# EAGLE board FPGA Test Board (EAGLE 9.2.0)
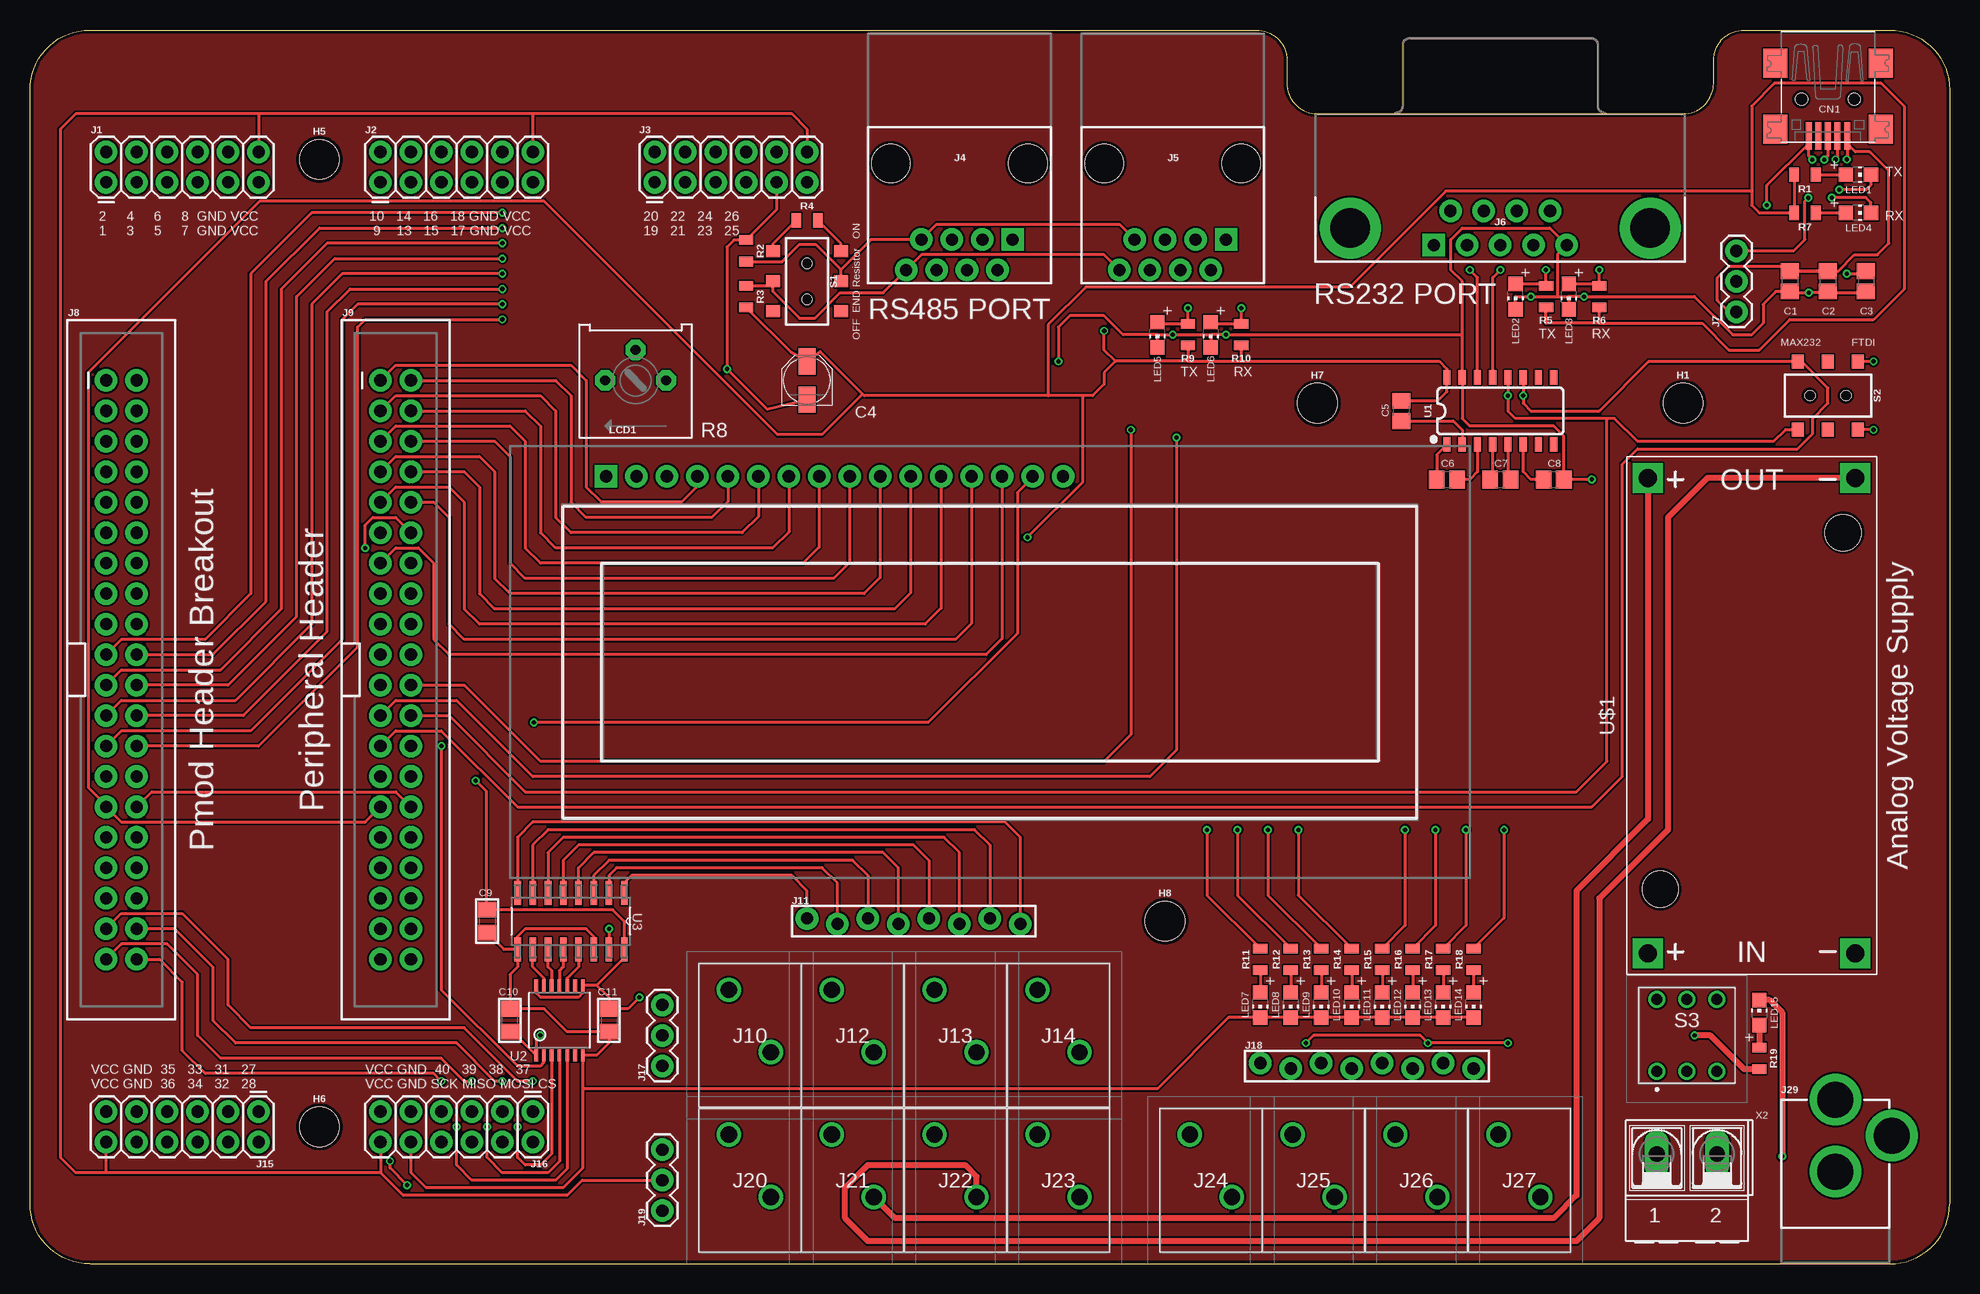
[diagram p4: board, top side]
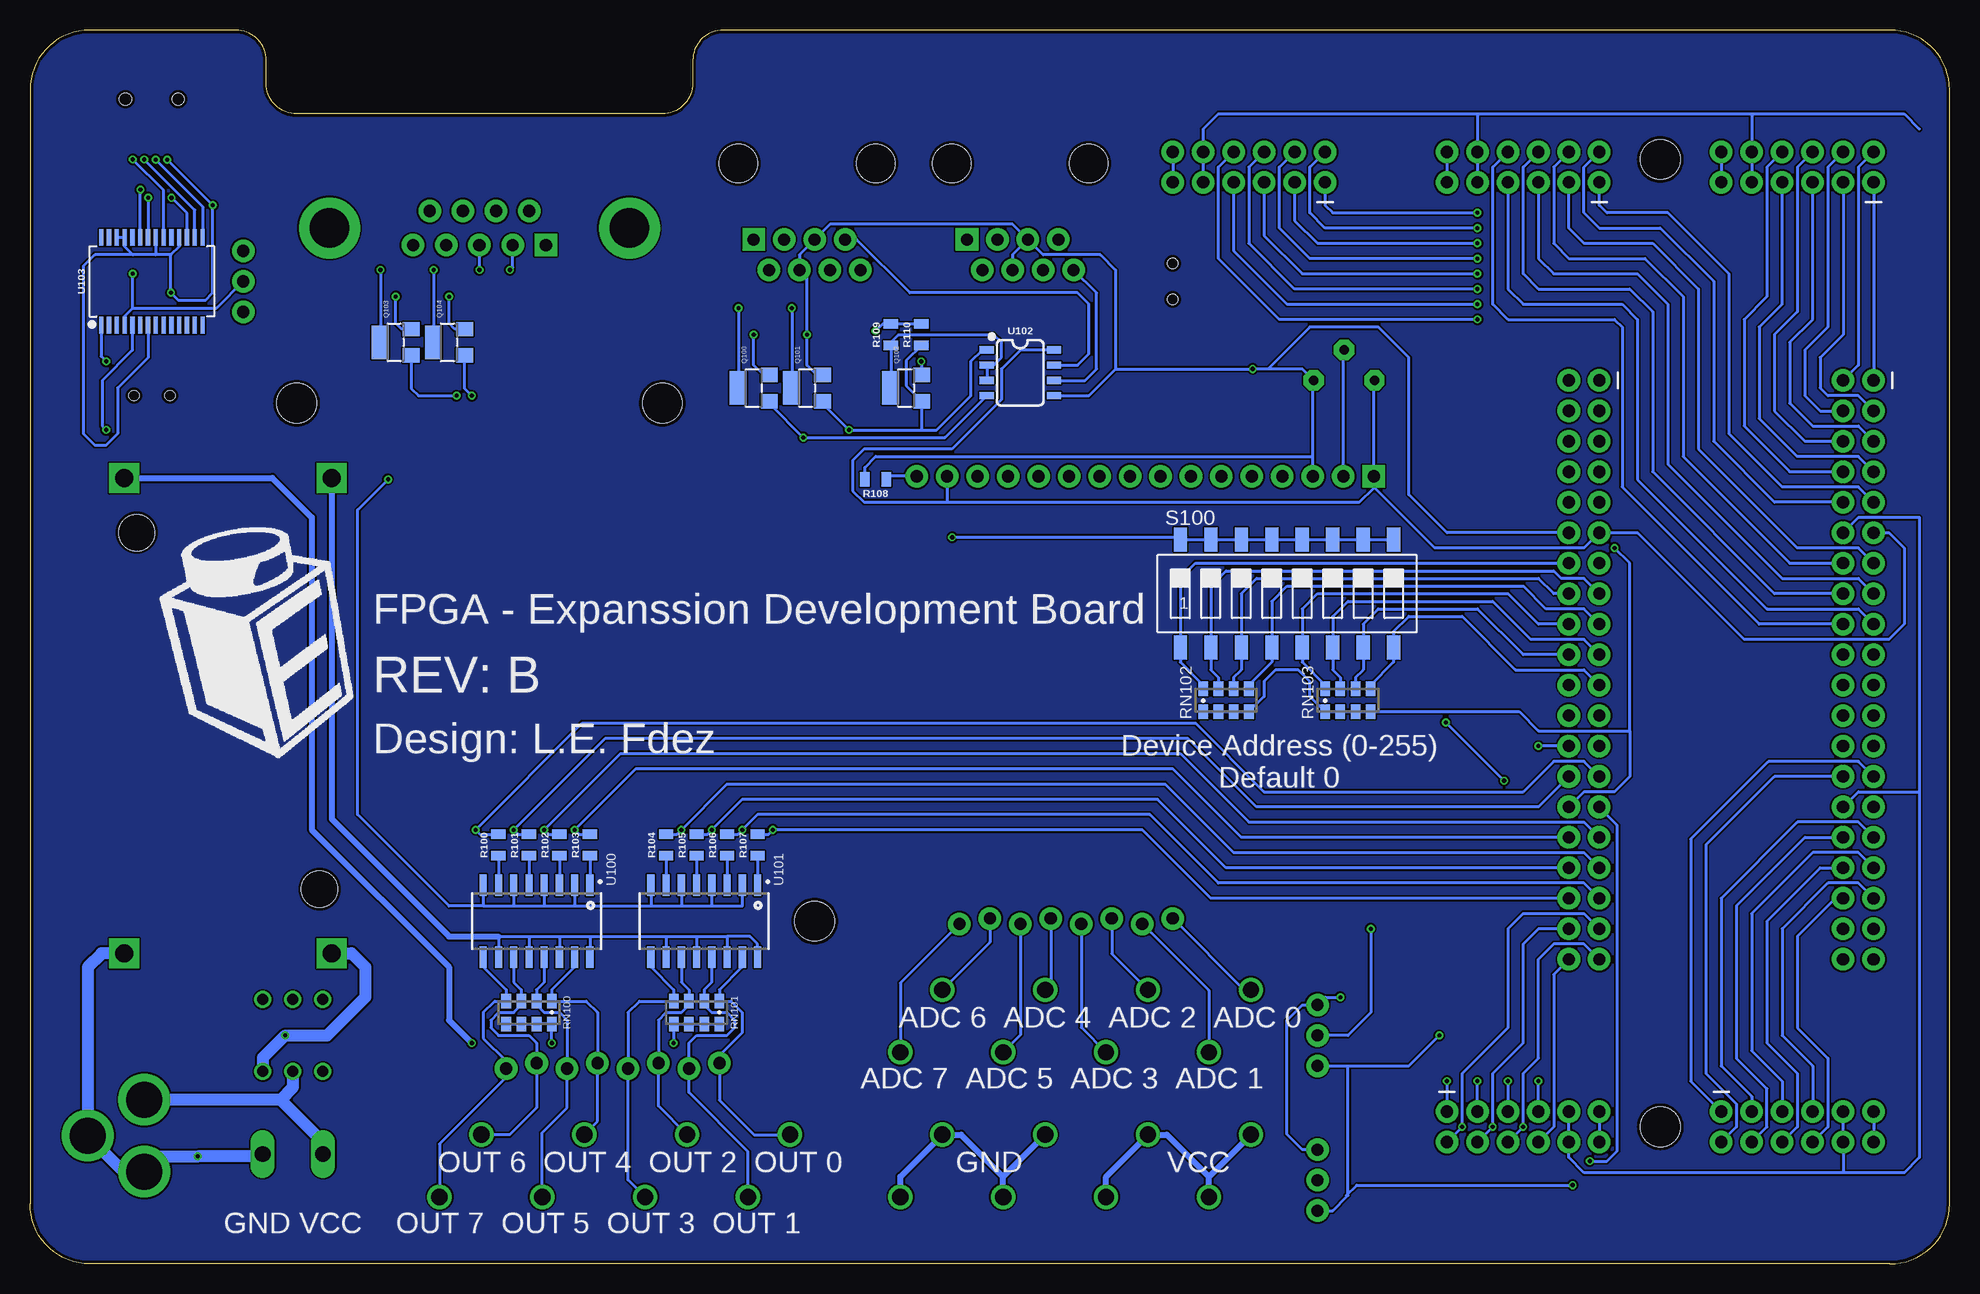
[diagram p5: board, bottom side, seen from below]

Size 160.02 x 102.87 mm. Coordinates in mm from the lower left corner, seen from the top.
Outline: 5,0 155.02,0 arc90 160.02,5 160.02,97.87 arc90 155.02,102.87 142.88,102.87 arc90 140.34,100.33 140.34,98.42 arc-90 137.79,95.89 107.31,95.89 arc-90 104.78,98.42 104.78,100.33 arc90 102.23,102.87 5,102.87 arc90 0,97.87 0,5 arc90 5,0
Copper layers (1*16): Top 0.035mm / dielectric 1.5mm / Bottom 0.035mm
Design rules "SeeedStudio_2layer_DRU_no_angle_20140221": minimum track width 6mil, minimum drill 12mil, track to track 6mil, track to pad 6mil, pad to pad 6mil, via to via 6mil, smd to smd 0mil, copper to edge 10mil, drill to drill 10mil, minimum pad ring 10mil, minimum via ring 6mil, stop-mask expansion 2mil, vias tented up to drill 100mil, thermal gap 10mil
Net classes: 1 power: width 0.254 mm

## Footprints (pad centres in the part's own frame; a part is rotated, then mirrored left to right if it is on the bottom)
C0805 = smd 1.3 x 1.5: 1 -0.85,0; 2 0.85,0
PANASONIC_B = smd 2.2 x 1.4: + 1.6,0; - -1.6,0
0805_NOTHERMALS = smd 1.3 x 1.5: 1 -0.95,0; 2 0.95,0
USB-MINIB = smd 0.5 x 2.308: D+ 0,4.064; D- -0.8,4.064; GND 1.6,4.064; ID 0.8,4.064; VBUS -1.6,4.064 | smd 2 x 2.4: GND1 -4.4,-2; GND2 -4.4,3.5; GND3 4.4,3.5; GND4 4.4,-2 | hole 1: -2.2,1; 2.2,1
STAND-OFF = hole 3.302: 0,0
2X6 = drill 1.016 pad 1.88: 1 0,0; 2 0,2.54; 3 2.54,0; 4 2.54,2.54; 5 5.08,0; 6 5.08,2.54; 7 7.62,0; 8 7.62,2.54; 9 10.16,0; 10 10.16,2.54; 11 12.7,0; 12 12.7,2.54
RJ45-8 = drill 1 pad 1.88 square: 1 -4.445,6.35 | drill 1 pad 1.88: 2 -3.175,8.89; 3 -1.905,6.35; 4 -0.635,8.89; 5 0.635,6.35; 6 1.905,8.89; 7 3.175,6.35; 8 4.445,8.89 | hole 3.2: -5.715,0; 5.715,0
DB9 = drill 1.016 pad 1.88 square: 1 -5.54,-1.42 | drill 1.016 pad 1.88: 2 -2.77,-1.42; 3 0,-1.42; 4 2.77,-1.42; 5 5.54,-1.42; 6 -4.15,1.42; 7 -1.38,1.42; 8 1.38,1.42; 9 4.15,1.42 | drill 3.302 pad 5.08: G1 -12.5,0; G2 12.5,0
1X03 = drill 1.016 pad 1.88: 1 0,0; 2 2.54,0; 3 5.08,0
2X20_SHROUDED = drill 1.016 pad 1.88: 1 -1.27,24.13; 2 1.27,24.13; 3 -1.27,21.59; 4 1.27,21.59; 5 -1.27,19.05; 6 1.27,19.05; 7 -1.27,16.51; 8 1.27,16.51; 9 -1.27,13.97; 10 1.27,13.97; 11 -1.27,11.43; 12 1.27,11.43; 13 -1.27,8.89; 14 1.27,8.89; 15 -1.27,6.35; 16 1.27,6.35; 17 -1.27,3.81; 18 1.27,3.81; 19 -1.27,1.27; 20 1.27,1.27; 21 -1.27,-1.27; 22 1.27,-1.27; 23 -1.27,-3.81; 24 1.27,-3.81; 25 -1.27,-6.35; 26 1.27,-6.35; 27 -1.27,-8.89; 28 1.27,-8.89; 29 -1.27,-11.43; 30 1.27,-11.43; 31 -1.27,-13.97; 32 1.27,-13.97; 33 -1.27,-16.51; 34 1.27,-16.51; 35 -1.27,-19.05; 36 1.27,-19.05; 37 -1.27,-21.59; 38 1.27,-21.59; 39 -1.27,-24.13; 40 1.27,-24.13
128340112 = drill 1.35 pad 2.025: 1 -1.75,3.8; 2 1.75,-1.4
1X08_FEMALE_LOCK = drill 1.016 pad 1.88: 1 0,0.229; 2 2.54,-0.229; 3 5.08,0.229; 4 7.62,-0.229; 5 10.16,0.229; 6 12.7,-0.229; 7 15.24,0.229; 8 17.78,-0.229
POWER_JACK_PTH = drill 2.997 pad 4.318: GND 0,7.7; GNDBREAK 4.7,10.7; PWR 0,13.7
LCD-16X2_NOHOLESNOSILK = drill 1.016 pad 1.88 square: 1 -32,15.5 | drill 1.016 pad 1.88: 2 -29.46,15.5; 3 -26.92,15.5; 4 -24.38,15.5; 5 -21.84,15.5; 6 -19.3,15.5; 7 -16.76,15.5; 8 -14.22,15.5; 9 -11.68,15.5; 10 -9.14,15.5; 11 -6.6,15.5; 12 -4.06,15.5; 13 -1.52,15.5; 14 1.02,15.5; 15 3.56,15.5; 16 6.1,15.5
CHIP-LED0805 = smd 1.2 x 1.2: A 0,-1.05; C 0,1.05
SOT23-W = smd 1.2 x 1.4: 1 -1.1,-1.3; 2 1.1,-1.3 | smd 2.8 x 1.4: 3 0,1.3
0805 = smd 0.8 x 1.2: 1 -0.9,0; 2 0.9,0
3386P = drill 0.813 pad 1.676 octagon: 1 -2.54,0; 2 0,-2.54; 3 2.54,0
743-8NS = smd 0.8 x 1.2: 1 -1.905,-0.953; 2 -0.635,-0.953; 3 0.635,-0.953; 4 1.905,-0.953; 5 1.905,0.953; 6 0.635,0.953; 7 -0.635,0.953; 8 -1.905,0.953
SWITCH_DPDT_SMD_AYZ0202 = smd 1 x 1.15: 1 -2.5,2.825; 2 0,2.825; 3 2.5,2.825; 4 -2.5,-2.825; 5 0,-2.825; 6 2.5,-2.825 | hole 0.85: 1.5,0; -1.5,0
TL2285EE = drill 0.9 pad 1.4: 1 -2.5,-3; 2 0,-3; 3 2.5,-3; 4 -2.5,3; 5 0,3; 6 2.5,3
SMS-008 = smd 1.092 x 2.007: 1 -8.89,-4.496; 2 -6.35,-4.496; 3 -3.81,-4.496; 4 -1.27,-4.496; 5 1.27,-4.496; 6 3.81,-4.496; 7 6.35,-4.496; 8 8.89,-4.496; 9 8.89,4.496; 10 6.35,4.496; 11 3.81,4.496; 12 1.27,4.496; 13 -1.27,4.496; 14 -3.81,4.496; 15 -6.35,4.496; 16 -8.89,4.496
SO16 = smd 0.6 x 1.2: 1 -4.445,-2.8; 2 -3.175,-2.8; 3 -1.905,-2.8; 4 -0.635,-2.8; 5 0.635,-2.8; 6 1.905,-2.8; 7 3.175,-2.8; 8 4.445,-2.8; 9 4.445,2.8; 10 3.175,2.8; 11 1.905,2.8; 12 0.635,2.8; 13 -0.635,2.8; 14 -1.905,2.8; 15 -3.175,2.8; 16 -4.445,2.8
TSSOP14 = smd 0.305 x 0.991: 1 -1.95,-2.918; 2 -1.3,-2.918; 3 -0.65,-2.918; 4 0,-2.918; 5 0.65,-2.918; 6 1.3,-2.918; 7 1.95,-2.918; 8 1.95,2.918; 9 1.3,2.918; 10 0.65,2.918; 11 0,2.918; 12 -0.65,2.918; 13 -1.3,2.918; 14 -1.95,2.918
SOIC127P600X175-16N = smd 1.981 x 0.559: 1 -2.362,4.445; 2 -2.362,3.175; 3 -2.362,1.905; 4 -2.362,0.635; 5 -2.362,-0.635; 6 -2.362,-1.905; 7 -2.362,-3.175; 8 -2.362,-4.445; 9 2.362,-4.445; 10 2.362,-3.175; 11 2.362,-1.905; 12 2.362,-0.635; 13 2.362,0.635; 14 2.362,1.905; 15 2.362,3.175; 16 2.362,4.445
SOIC127P686X201-16N = smd 1.82 x 0.6: 1 -3,4.445; 2 -3,3.175; 3 -3,1.905; 4 -3,0.635; 5 -3,-0.635; 6 -3,-1.905; 7 -3,-3.175; 8 -3,-4.445; 9 3,-4.445; 10 3,-3.175; 11 3,-1.905; 12 3,-0.635; 13 3,0.635; 14 3,1.905; 15 3,3.175; 16 3,4.445
SO08 = smd 0.6 x 1.2: 1 -1.905,-2.8; 2 -0.635,-2.8; 3 0.635,-2.8; 4 1.905,-2.8; 5 1.905,2.8; 6 0.635,2.8; 7 -0.635,2.8; 8 -1.905,2.8
SSOP28DB = smd 0.348 x 1.397: 1 -4.225,-3.656; 2 -3.575,-3.656; 3 -2.925,-3.656; 4 -2.275,-3.656; 5 -1.625,-3.656; 6 -0.975,-3.656; 7 -0.325,-3.656; 8 0.325,-3.656; 9 0.975,-3.656; 10 1.625,-3.656; 11 2.275,-3.656; 12 2.925,-3.656; 13 3.575,-3.656; 14 4.225,-3.656; 15 4.225,3.656; 16 3.575,3.656; 17 2.925,3.656; 18 2.275,3.656; 19 1.625,3.656; 20 0.975,3.656; 21 0.325,3.656; 22 -0.325,3.656; 23 -0.975,3.656; 24 -1.625,3.656; 25 -2.275,3.656; 26 -2.925,3.656; 27 -3.575,3.656; 28 -4.225,3.656
DC-DC-STEP-DOWN-LM2596 = drill 1.5 pad 2.5 square: IN+ -19.812,8.636; IN- -19.812,-8.636; OUT+ 19.812,8.636; OUT- 19.812,-8.636 | hole 3: -14.478,7.62; 15.24,-7.62
AK500/2-H = drill 1.321 long: 1 -2.515,0; 2 2.515,0

## Placement (x,y rotation side)
C1  0.1uF  [C0805]  146.69,81.92 270 top
C2  10uF  [C0805]  149.86,81.92 270 top
C3  0.1uF  [C0805]  153.03,81.92 270 top
C4  1uF  [PANASONIC_B]  64.77,73.66 90 top
C5  1uF  [C0805]  114.3,71.12 90 top
C6  1uF  [C0805]  118.11,65.41 0 top
C7  1uF  [C0805]  122.56,65.41 0 top
C8  1uF  [C0805]  127,65.41 0 top
C9  4.7uF  [0805_NOTHERMALS]  38.1,28.57 270 top
C10  0.1uF  [0805_NOTHERMALS]  40.01,20.32 90 top
C11  0.1uF  [0805_NOTHERMALS]  48.26,20.32 270 top
CN1  [USB-MINIB]  149.86,98.11 180 top
H1  STAND-OFF  [STAND-OFF]  137.79,71.75 0 top
H5  STAND-OFF  [STAND-OFF]  24.13,92.08 0 top
H6  STAND-OFF  [STAND-OFF]  24.13,11.43 0 top
H7  STAND-OFF  [STAND-OFF]  107.31,71.75 0 top
H8  STAND-OFF  [STAND-OFF]  94.61,28.57 0 top
J1  2X6 FEMALE  [2X6]  6.35,90.17 0 top
J2  2X6 FEMALE  [2X6]  29.21,90.17 0 top
J3  2X6 FEMALE  [2X6]  52.07,90.17 0 top
J4  RJ45  [RJ45-8]  77.47,91.76 180 top
J5  RJ45  [RJ45-8]  95.25,91.76 180 top
J6  [DB9]  122.56,86.36 0 top
J7  455-1750-1-ND  [1X03]  142.24,79.38 90 top
J8  CONN_20X2SHROUDED  [2X20_SHROUDED]  7.62,49.53 0 top
J9  CONN_20X2SHROUDED  [2X20_SHROUDED]  30.48,49.53 0 top
J10  1-2834011-2  [128340112]  60.01,19.05 0 top
J11  [1X08_FEMALE_LOCK]  64.77,28.57 0 top
J12  1-2834011-2  [128340112]  68.58,19.05 0 top
J13  1-2834011-2  [128340112]  77.15,19.05 0 top
J14  1-2834011-2  [128340112]  85.72,19.05 0 top
J15  2X6 FEMALE  [2X6]  19.05,12.7 180 top
J16  2X6 FEMALE  [2X6]  41.91,12.7 180 top
J17  455-1750-1-ND  [1X03]  52.7,16.51 90 top
J18  [1X08_FEMALE_LOCK]  102.55,16.51 0 top
J19  455-1750-1-ND  [1X03]  52.7,4.45 90 top
J20  1-2834011-2  [128340112]  60.01,6.99 0 top
J21  1-2834011-2  [128340112]  68.58,6.99 0 top
J22  1-2834011-2  [128340112]  77.15,6.99 0 top
J23  1-2834011-2  [128340112]  85.72,6.99 0 top
J24  1-2834011-2  [128340112]  98.42,6.99 0 top
J25  1-2834011-2  [128340112]  107,6.99 0 top
J26  1-2834011-2  [128340112]  115.57,6.99 0 top
J27  1-2834011-2  [128340112]  124.14,6.99 0 top
J29  POWER_JACK  [POWER_JACK_PTH]  150.5,0 0 top
LCD1  LCD-16X2NOHOLES  [LCD-16X2_NOHOLESNOSILK]  80.01,50.16 0 top
LED1  [CHIP-LED0805]  152.4,90.81 270 top
LED2  [CHIP-LED0805]  123.83,80.64 180 top
LED3  [CHIP-LED0805]  128.27,80.64 180 top
LED4  [CHIP-LED0805]  152.4,87.63 270 top
LED5  [CHIP-LED0805]  93.98,77.47 180 top
LED6  [CHIP-LED0805]  98.42,77.47 180 top
LED7  [CHIP-LED0805]  102.55,21.59 180 top
LED8  [CHIP-LED0805]  105.09,21.59 180 top
LED9  [CHIP-LED0805]  107.63,21.59 180 top
LED10  [CHIP-LED0805]  110.17,21.59 180 top
LED11  [CHIP-LED0805]  112.71,21.59 180 top
LED12  [CHIP-LED0805]  115.25,21.59 180 top
LED13  [CHIP-LED0805]  117.79,21.59 180 top
LED14  [CHIP-LED0805]  120.33,21.59 180 top
LED15  [CHIP-LED0805]  144.15,20.95 0 top
Q100  [SOT23-W]  99.69,73.03 90 bottom
Q101  [SOT23-W]  95.25,73.03 90 bottom
Q102  [SOT23-W]  87,73.03 90 bottom
Q103  [SOT23-W]  129.54,76.83 90 bottom
Q104  [SOT23-W]  125.09,76.83 90 bottom
R1  1k  [0805]  147.96,90.81 180 top
R2  1k  [0805]  59.69,84.45 270 top
R3  1k  [0805]  59.69,80.64 270 top
R4  270E  [0805]  64.77,87 180 top
R5  1k  [0805]  126.36,80.64 270 top
R6  1k  [0805]  130.81,80.64 270 top
R7  1k  [0805]  147.96,87.63 180 top
R8  [3386P]  50.48,73.66 180 top
R9  1k  [0805]  96.52,77.47 270 top
R10  1k  [0805]  100.97,77.47 270 top
R11  100E  [0805]  102.55,25.4 90 top
R12  100E  [0805]  105.09,25.4 90 top
R13  100E  [0805]  107.63,25.4 90 top
R14  100E  [0805]  110.17,25.4 90 top
R15  100E  [0805]  112.71,25.4 90 top
R16  100E  [0805]  115.25,25.4 90 top
R17  100E  [0805]  117.79,25.4 90 top
R18  100E  [0805]  120.33,25.4 90 top
R19  1k  [0805]  144.15,17.14 270 top
R100  100E  [0805]  120.97,34.92 90 bottom
R101  100E  [0805]  118.43,34.92 90 bottom
R102  100E  [0805]  115.89,34.92 90 bottom
R103  100E  [0805]  113.35,34.92 90 bottom
R104  100E  [0805]  107,34.92 90 bottom
R105  100E  [0805]  104.46,34.92 90 bottom
R106  100E  [0805]  101.92,34.92 90 bottom
R107  100E  [0805]  99.38,34.92 90 bottom
R108  1k  [0805]  89.53,65.41 180 bottom
R109  10k  [0805]  88.27,77.47 90 bottom
R110  10k  [0805]  85.72,77.47 90 bottom
RN100  1k  [743-8NS]  118.43,20.95 180 bottom
RN101  1k  [743-8NS]  104.46,20.95 180 bottom
RN102  1k  [743-8NS]  60.33,46.99 0 bottom
RN103  1k  [743-8NS]  50.16,46.99 0 bottom
S1  [SWITCH_DPDT_SMD_AYZ0202]  64.77,81.92 90 top
S2  [SWITCH_DPDT_SMD_AYZ0202]  149.86,72.39 180 top
S3  TL2285EE  [TL2285EE]  138.11,19.05 0 top
S100  SWS008  [SMS-008]  55.24,55.88 0 bottom
U1  MAX3232  [SO16]  122.56,71.12 0 top
U2  [TSSOP14]  44.13,20.32 0 top
U3  MCP3008-I/SL  [SOIC127P600X175-16N]  45.09,28.57 270 top
U100  TCMD4000  [SOIC127P686X201-16N]  117.79,28.57 270 bottom
U101  TCMD4000  [SOIC127P686X201-16N]  103.82,28.57 270 bottom
U102  MAX3485CSA  [SO08]  77.47,74.3 270 bottom
U103  FT232RL  [SSOP28DB]  149.86,81.92 0 bottom
U$1  DC-DC-STEP-DOWN-LM2596  [DC-DC-STEP-DOWN-LM2596]  143.51,45.72 90 top
X2  [AK500/2-H]  138.11,9.16 0 top

## Tracks (layer width: path | path; a pad name or v marks a point on that pad's centre or on a via)
3.3V  (via drill 0.35)
  Top 0.254: C10.1 40.22,19.37 U2.1 42.18,18.69 v42.55,19.05 | C5.2 117.37,71.97 118.11,72.71 U1.16 118.11,74.61 117.47,75.25 100.97,75.25 | 130.81,78.42 126.36,78.42 R5.2 | 130.81,78.42 R6.2 | R9.2 96.52,75.25 | 96.52,75.25 100.97,75.25 | 100.97,75.25 R10.2 | 96.52,75.25 90.49,75.25 | 90.49,75.25 89.53,76.2 v89.53,77.79 | R3.2 63.38,76.06 C4.+ 65.86,76.06 69.39,72.53 | R1.2 R7.2 144.15,87.63 143.51,88.27 143.51,89.44 | 90.49,75.25 89.53,74.3 89.53,73.34 88.58,72.39 87.72,72.39 | 87.72,72.39 84.87,72.39 | 84.87,72.39 69.53,72.39 69.39,72.53 | 130.81,78.42 139.38,78.42 141.6,76.2 144.15,76.2 146.69,78.74 153.67,78.74 156.21,81.28 156.21,96.52 154.31,98.42 145.41,98.42 143.51,96.52 143.51,89.44 | J9.29 27.94,36.83 7.62,36.83 J8.29 6.29,38.29 4.86,39.72 4.86,74.3 19.14,88.58 42.86,88.58 62.29,69.15 66.01,69.15 69.39,72.53 | v30,8.57 30,8 v31.43,6.57 | v83.15,60.58 87.72,65.15 87.72,72.39 | 84.87,72.39 84.87,78.3 88.01,81.44 110.01,81.44 118.02,89.44 143.51,89.44
  Bottom 0.254: v42.55,19.05 45.09,16.51 50.16,16.51 | J17.1 50.16,16.51 | J19.1 51.44,4.45 50.23,5.65 | 50.23,5.65 50.16,5.71 50.16,16.51 | S100.9 S100.10 S100.11 S100.12 S100.13 S100.14 S100.15 S100.16 64.29,60.58 v83.15,60.58 | R110.2 R109.2 88.95,78.37 v89.53,77.79 | v30,8.57 28.57,8.57 27.72,9.43 27.72,36.58 29.15,38.01 J9.29 | v31.43,6.57 49.44,6.57 50.29,5.71 50.23,5.65
5V  (via drill 0.35)
  Top 0.254: 47.25,23.24 U2.8 46.08,22.59 45.72,22.23 42.55,22.23 42.18,22.59 U2.14 | 47.25,23.24 48.26,22.23 C11.1 49.84,21.27 v50.8,22.23 | 47.25,23.24 49.53,25.52 U3.16 49.53,28.57 48.58,29.52 C9.1 38.01,29.72 38.01,39.43 v37.15,40.29 | v42.01,45.15 74.87,45.15 82.3,52.58 82.3,64.29 83.44,65.44 LCD1.15
  Bottom 0.254: v50.8,22.23 52.07,22.23 J17.3 53.98,21.59 55.24,20.32 55.24,10.79 53.98,9.53 J19.3 | 83.5,63.5 90.49,63.5 91.44,64.45 91.44,66.99 90.49,67.94 83.19,67.94 79.06,72.07 79.06,74.61 77.47,76.2 U102.8 | 83.5,63.5 49.21,63.5 48.01,64.7 48.01,64.77 | 48.01,64.77 LCD1.1 48.01,73.59 R8.3 | LCD1.15 83.57,63.57 83.5,63.5 | 48.01,64.77 42.93,59.69 30.48,59.69 J9.11 26.04,60.96 17.14,52.07 5.08,52.07 3.81,53.34 3.81,59.69 5.08,60.96 J8.11 | v42.01,45.15 v37.15,40.29
232_RX  (via drill 0.35)
  Top 0.254: U1.11 v124.46,72.39 124.46,71.75 125.09,71.12 130.81,71.12 134.91,75.22 S2.6 147.67,75.22 149.86,73.03 149.86,71.75 148.59,70.48 148.59,69.22 147.32,67.94 133.99,67.94 132.72,66.67 132.72,40.64 130.18,38.1 40.64,38.1 34.29,44.45 30.48,44.45 J9.25
  Bottom 0.254: v124.46,72.39 127.64,72.39 128.24,73 Q103.1
232_TX  (via drill 0.35)
  Top 0.254: U1.12 v123.19,72.39 123.19,71.12 123.83,70.48 131.44,70.48 | S2.3 146.34,69.56 145.35,68.58 133.99,68.58 132.08,70.48 131.44,70.48 | J9.24 34.92,45.72 41.27,39.37 128.91,39.37 131.44,41.91 131.44,70.48
  Bottom 0.254: v123.19,72.39 123.8,73 Q104.1
485_RX  (via drill 0.35)
  Top 0.254: J9.23 30.48,46.99 35.56,46.99 41.91,40.64 93.34,40.64 95.57,42.86 v95.57,68.9
  Bottom 0.254: U102.4 83.76,68.9 v95.57,68.9 98.39,71.72 Q100.1
485_TX  (via drill 0.35)
  Top 0.254: J9.22 36.2,48.26 42.55,41.91 89.53,41.91 91.76,44.13 v91.76,69.53
  Bottom 0.254: R110.1 87,75.3 87,73.22 Q102.1 85.69,69.56 85.72,69.53 | 85.72,69.53 v91.76,69.53 93.95,71.72 Q101.1 | 85.72,69.53 84.45,69.53 81.6,72.39 81.6,75.25 80.64,76.2 U102.1
ADC_0
  Top 0.254: U3.1 49.53,31.75 50.16,32.38 63.5,32.38 64.77,31.11 J11.1
  Bottom 0.254: J11.1 58.82,22.85 J10.1
ADC_1
  Top 0.254: U3.2 48.26,32.38 48.9,33.02 66.04,33.02 67.31,31.75 J11.2
  Bottom 0.254: J11.2 61.76,22.79 J10.2
ADC_2
  Top 0.254: U3.3 46.99,32.38 48.26,33.66 68.58,33.66 69.85,32.38 J11.3
  Bottom 0.254: J12.1 69.85,25.87 J11.3
ADC_3
  Top 0.254: J11.4 72.39,33.02 71.12,34.29 46.99,34.29 45.72,33.02 U3.4
  Bottom 0.254: J12.2 72.39,19.71 J11.4
ADC_4
  Top 0.254: U3.5 44.45,33.66 45.72,34.92 73.66,34.92 74.93,33.66 J11.5
  Bottom 0.254: J13.1 74.93,23.32 J11.5
ADC_5
  Top 0.254: U3.6 43.18,34.29 44.45,35.56 76.2,35.56 77.47,34.29 J11.6
  Bottom 0.254: J13.2 77.47,19.08 J11.6
ADC_6
  Top 0.254: U3.7 41.91,34.92 43.18,36.2 78.74,36.2 80.01,34.92 J11.7
  Bottom 0.254: J14.1 80.01,26.82 J11.7
ADC_7
  Top 0.254: U3.8 40.64,35.56 41.91,36.83 81.28,36.83 82.55,35.56 J11.8
  Bottom 0.254: J11.8 87.47,23.42 J14.2
AGND  (via drill 0.35)
  Top 0.254: v106.36,18.41 107,19.05 115.89,19.05 v116.52,18.41 v123.19,18.41
  Top 0.508: U$1.OUT- 139.83,65.53 136.53,62.23 136.53,36.2 130.81,30.48 130.81,3.81 128.91,1.91 69.85,1.91 67.94,3.81 67.94,6.35 69.85,8.26 77.93,8.26 78.9,7.29 J22.2
  Bottom 0.254: RN100.5 RN100.6 RN100.7 RN100.8 v116.52,18.41 | RN101.8 RN101.7 RN101.6 RN101.5 v106.36,18.41
  Bottom 0.508: U$1.OUT- 139.83,65.53 136.53,62.23 136.53,36.2 125.09,24.77 125.09,20.32 v123.19,18.41 | J22.2 78.9,7.29 | 78.9,7.29 J22.1 | J23.2 87.47,7.29 J23.1 82.4,10.79 78.9,7.29
CS  (via drill 0.35)
  Top 0.254: v34.29,43.18 34.29,22.86 40.64,16.51 42.55,16.51 42.83,16.8 U2.2
  Bottom 0.254: J9.26 v34.29,43.18
FTDI_RX  (via drill 0.35)
  Top 0.254: v153.67,75.25 153.64,75.22 S2.4
  Bottom 0.254: U103.1 154.09,75.66 v153.67,75.25
FTDI_TX  (via drill 0.35)
  Top 0.254: S2.1 153.64,69.56 v153.67,69.53
  Bottom 0.254: v153.67,69.53 153.99,69.85 153.99,73.66 151.49,76.16 U103.5
GND  (via drill 0.35)
  Top 0.254: LED14.C LED13.C LED12.C LED11.C LED10.C LED9.C LED8.C LED7.C 99.92,20.54 93.98,14.61 46.08,14.61 | U3.9 39.51,26.21 C9.2 | U3.9 40.64,24.77 40.01,24.13 C10.2 42.87,21.27 44.77,19.37 C11.2 48.26,18.41 47.25,17.4 U2.7 46.08,14.61 | U3.14 46.99,27.3 46.35,27.94 41.27,27.94 40.64,27.3 U3.9 | LED2.C 123.83,80.64 v125.09,80.64 127.32,80.64 | 127.32,80.64 128.27,80.64 | 128.27,80.64 LED3.C | 128.27,80.64 v129.54,80.64 138.75,80.64 141.92,77.47 143.51,77.47 144.46,78.42 144.46,80.01 145.52,81.06 C1.2 146.79,80.96 v148.27,80.96 149.76,80.96 C2.2 149.96,80.96 152.93,80.96 C3.2 | 127.32,80.64 127.32,84.16 J6.5 126.67,86.36 119.38,86.36 118.43,85.41 118.43,82.87 119.38,81.92 119.38,77.47 | LED5.C 93.98,77.47 | 93.98,77.47 v95.25,77.47 98.42,77.47 | 98.42,77.47 LED6.C | 98.42,77.47 v99.69,77.47 119.38,77.47 | C4.- 61.45,71.26 v58.1,74.61 58.1,84.77 58.69,85.36 R2.1 62.23,87.89 J3.9 | 93.98,77.47 91.12,77.47 89.53,79.06 86.68,79.06 85.72,78.11 v85.72,75.25 | v148.57,92.06 148.26,92.37 148.26,93.41 | v144.78,88.27 144.78,89.92 148.26,93.41 | CN1.GND 148.26,93.41 | 119.38,77.47 U1.15 119.38,70.48 120.02,69.85 127,69.85 127.85,69 C8.2 v130.18,65.41 | 46.08,14.61 46.08,7.98 44.45,6.35 33.02,6.35 31.75,7.62 J16.10 | J8.30 10.16,39.37 30.48,39.37 J9.30 | v27.94,59.69 27.94,61.59 28.57,62.23 30.48,62.23 J9.12
  Bottom 0.254: J1.9 J1.10 16.51,95.89 | J2.9 J2.10 39.37,95.89 | J3.9 J3.10 62.23,94.61 60.96,95.89 39.37,95.89 | J15.9 J15.10 8.89,7.62 | J16.9 J16.10 31.75,8.89 30.48,7.62 8.89,7.62 | U100.8 122.24,29.84 | 122.24,29.84 119.7,29.84 | 119.7,29.84 117.16,29.84 | 117.16,29.84 114.62,29.84 | 114.62,29.84 108.27,29.84 | 108.27,29.84 105.73,29.84 | 105.73,29.84 103.19,29.84 | 103.19,29.84 100.65,29.84 U101.2 | U101.4 103.19,29.84 | U101.6 105.73,29.84 | U101.8 108.27,29.84 | U100.2 114.62,29.84 | U100.4 117.16,29.84 | U100.6 119.7,29.84 | LCD1.3 53.09,67.31 | 53.09,67.31 53.09,73.59 R8.1 53.98,74.61 v58.1,74.61 | RN102.1 RN102.2 RN102.3 RN102.4 57.15,47.31 57.15,48.58 56.2,49.53 54.29,49.53 53.34,48.58 53.34,47.31 RN103.1 RN103.2 RN103.3 RN103.4 35.88,46.04 34.29,44.45 26.67,44.45 | Q104.2 124.61,77.94 125.09,78.42 v125.09,80.64 | Q103.2 129.05,77.94 129.54,78.42 v129.54,80.64 | Q101.2 94.44,74.12 95.25,74.93 v95.25,77.47 95.25,82.23 J5.4 95.89,84.14 J5.5 93.34,86.68 78.11,86.68 J4.5 | Q100.2 98.89,74.12 99.69,74.93 v99.69,77.47 | R108.2 90.44,66.41 89.53,67.31 53.09,67.31 | J4.5 78.11,84.14 J4.4 | v85.72,75.25 85.72,74.16 Q102.2 | U103.26 U103.25 152.13,84.83 151.45,84.14 | v148.57,92.06 v144.78,88.27 144.78,80.96 145.41,80.33 147.64,80.33 v148.27,80.96 148.27,84.14 | U103.18 147.59,84.83 148.27,84.14 | 148.27,84.14 149.54,84.14 | 149.54,84.14 151.45,84.14 | U103.21 149.54,84.14 | 39.37,95.89 16.51,95.89 | 16.51,95.89 3.81,95.89 2.54,94.61 | 2.54,39.37 2.54,62.23 7.62,62.23 J8.12 | 2.54,39.37 2.54,8.89 3.81,7.62 8.89,7.62 | J8.30 7.62,39.37 2.54,39.37 | U102.5 71.75,72.39 69.53,74.61 | 69.53,74.61 69.53,82.87 70.8,84.14 75.56,84.14 J4.5
  Bottom 0.254: 69.53,74.61 v58.1,74.61 | 151.45,84.14 154.62,84.14 155.57,83.19 155.57,69.22 154.62,68.26 153.67,68.26 152.72,69.22 152.72,73.03 150.19,75.56 U103.7 | 122.24,29.84 125.09,29.84 132.72,37.47 132.72,62.87 v130.18,65.41 | J9.12 41.91,60.96 45.09,64.14 45.09,75.56 47.62,78.11 53.34,78.11 56.83,74.61 v58.1,74.61 | J9.30 30.48,39.37 27.94,39.37 26.67,40.64 26.67,44.45 | 26.67,44.45 26.67,58.42 v27.94,59.69
JA_0
  Bottom 0.254: J1.1 J8.1
JA_1
  Bottom 0.254: J1.2 7.62,91.44 7.62,74.93 J8.2
JA_2
  Bottom 0.254: J1.3 8.89,77.47 10.79,75.56 10.79,73.03 10.16,72.39 7.62,72.39 J8.3
JA_3
  Bottom 0.254: J1.4 10.16,91.44 10.16,78.11 12.06,76.2 12.06,72.39 10.79,71.12 J8.4
JA_4
  Bottom 0.254: J8.5 7.62,69.85 11.43,69.85 13.34,71.75 13.34,76.83 11.43,78.74 J1.5
JA_5
  Bottom 0.254: J1.6 12.7,91.44 12.7,79.38 14.61,77.47 14.61,71.12 12.06,68.58 J8.6
JA_6
  Bottom 0.254: J8.7 7.62,67.31 12.7,67.31 15.88,70.48 15.88,78.11 13.97,80.01 J1.7
JA_7
  Bottom 0.254: J1.8 15.24,91.44 15.24,80.64 17.14,78.74 17.14,69.85 13.34,66.04 J8.8
JB_0
  Bottom 0.254: J8.9 7.62,64.77 13.97,64.77 18.41,69.22 18.41,82.55 23.5,87.63 28.57,87.63 29.21,88.27 J2.1
JB_1
  Bottom 0.254: J8.10 14.61,63.5 19.68,68.58 19.68,81.92 24.13,86.36 29.21,86.36 30.48,87.63 30.48,91.44 J2.2
JB_2
  Bottom 0.254: J8.13 7.62,59.69 12.7,59.69 20.95,67.94 20.95,81.28 24.77,85.09 30.48,85.09 31.75,86.36 J2.3
JB_3
  Bottom 0.254: J2.4 33.02,91.44 33.02,85.09 31.75,83.82 25.4,83.82 22.23,80.64 22.23,67.31 13.34,58.42 J8.14
JB_4
  Bottom 0.254: J2.5 34.29,83.82 33.02,82.55 26.04,82.55 23.5,80.01 23.5,66.67 13.97,57.15 7.62,57.15 J8.15
JB_5
  Bottom 0.254: J8.16 14.61,55.88 24.77,66.04 24.77,79.38 26.67,81.28 34.29,81.28 35.56,82.55 35.56,91.44 J2.6
JB_6
  Bottom 0.254: J2.7 36.83,81.28 35.56,80.01 27.3,80.01 26.04,78.74 26.04,65.41 15.24,54.61 7.62,54.61 J8.17
JB_7
  Bottom 0.254: J8.18 15.88,53.34 27.3,64.77 27.3,78.11 27.94,78.74 36.83,78.74 38.1,80.01 38.1,91.44 J2.8
JC_0  (via drill 0.35)
  Top 0.254: v39.37,87.63 23.5,87.63 18.41,82.55 18.41,55.88 14.61,52.07 7.62,52.07 J8.19
  Bottom 0.254: J3.1 52.07,88.27 51.44,87.63 v39.37,87.63
JC_1  (via drill 0.35)
  Top 0.254: v39.37,86.36 24.13,86.36 19.68,81.92 19.68,55.24 15.24,50.8 J8.20
  Bottom 0.254: v39.37,86.36 52.07,86.36 53.34,87.63 53.34,91.44 J3.2
JC_2  (via drill 0.35)
  Top 0.254: v39.37,85.09 24.77,85.09 20.95,81.28 20.95,54.61 15.88,49.53 7.62,49.53 J8.21
  Bottom 0.254: J3.3 54.61,87 52.7,85.09 v39.37,85.09
JC_3  (via drill 0.35)
  Top 0.254: v39.37,83.82 25.4,83.82 22.23,80.64 22.23,53.98 16.51,48.26 J8.22
  Bottom 0.254: v39.37,83.82 53.34,83.82 55.88,86.36 55.88,91.44 J3.4
JC_4  (via drill 0.35)
  Top 0.254: v39.37,82.55 26.04,82.55 23.5,80.01 23.5,53.34 17.14,46.99 7.62,46.99 J8.23
  Bottom 0.254: J3.5 57.15,85.72 53.98,82.55 v39.37,82.55
JC_5  (via drill 0.35)
  Top 0.254: v39.37,81.28 26.67,81.28 24.77,79.38 24.77,52.7 17.78,45.72 J8.24
  Bottom 0.254: v39.37,81.28 54.61,81.28 58.42,85.09 58.42,91.44 J3.6
JC_6  (via drill 0.35)
  Top 0.254: v39.37,80.01 27.3,80.01 26.04,78.74 26.04,52.07 18.41,44.45 7.62,44.45 J8.25
  Bottom 0.254: J3.7 59.69,84.45 55.24,80.01 v39.37,80.01
JC_7  (via drill 0.35)
  Top 0.254: v39.37,78.74 27.94,78.74 27.3,78.11 27.3,51.44 19.05,43.18 J8.26
  Bottom 0.254: v39.37,78.74 55.88,78.74 60.96,83.82 60.96,91.44 J3.8
JD_0
  Bottom 0.254: J8.27 7.62,41.91 7.64,41.88 15.12,41.88 21.59,35.41 21.59,15.24 J15.1
JD_1
  Bottom 0.254: J8.28 14.61,40.64 20.32,34.92 20.32,15.88 17.78,13.34 17.78,11.43 J15.2
JD_2
  Bottom 0.254: J8.31 7.62,36.83 12.7,36.83 19.05,30.48 19.05,16.51 16.51,13.97 J15.3
JD_3
  Bottom 0.254: J15.4 15.24,11.43 15.24,14.61 17.78,17.14 17.78,29.84 12.06,35.56 J8.32
JD_4
  Bottom 0.254: J8.33 7.62,34.29 11.43,34.29 16.51,29.21 16.51,17.78 13.97,15.24 J15.5
JD_5
  Bottom 0.254: J15.6 12.7,11.43 12.7,15.88 15.24,18.41 15.24,28.57 10.79,33.02 J8.34
JD_6
  Bottom 0.254: J8.35 7.62,31.75 10.16,31.75 13.97,27.94 13.97,19.05 11.43,16.51 J15.7
JD_7
  Bottom 0.254: J15.8 10.16,11.43 10.16,17.14 12.7,19.68 12.7,27.3 9.53,30.48 J8.36
JE_0  (via drill 0.35)
  Top 0.254: v41.91,15.24 40.64,15.24 36.2,19.68 18.41,19.68 16.51,21.59 16.51,25.4 12.7,29.21 7.62,29.21 J8.37
  Bottom 0.254: v41.91,15.24 J16.1
JE_1  (via drill 0.35)
  Top 0.254: U2.3 43.48,9.19 42.55,8.26 41.27,8.26 40.64,8.89 v40.64,11.43
  Bottom 0.254: J9.37 30.48,29.21 35.56,29.21 36.83,27.94 36.83,19.68 40.64,15.88 v40.64,11.43 J16.2
JE_2  (via drill 0.35)
  Top 0.254: v39.37,15.24 38.73,15.24 35.56,18.41 17.14,18.41 15.24,20.32 15.24,24.77 12.06,27.94 J8.38
  Bottom 0.254: J16.3 v39.37,15.24
JE_3  (via drill 0.35)
  Top 0.254: U2.4 44.13,8.57 43.18,7.62 39.37,7.62 38.1,8.89 v38.1,11.43
  Bottom 0.254: J9.38 34.29,27.94 35.56,26.67 35.56,18.41 38.1,15.88 v38.1,11.43 J16.4
JE_4  (via drill 0.35)
  Top 0.254: v36.83,15.24 36.2,15.24 34.29,17.14 15.88,17.14 13.97,19.05 13.97,24.13 11.43,26.67 7.62,26.67 J8.39
  Bottom 0.254: v36.83,15.24 J16.5
JE_5  (via drill 0.35)
  Top 0.254: U2.5 44.78,7.95 43.81,6.99 36.83,6.99 35.56,8.26 v35.56,11.43
  Bottom 0.254: J9.39 30.48,26.67 33.02,26.67 34.29,25.4 34.29,17.14 35.56,15.88 v35.56,11.43 J16.6
JE_6  (via drill 0.35)
  Top 0.254: v34.29,15.24 33.66,15.88 14.61,15.88 12.7,17.78 12.7,23.5 10.79,25.4 J8.40
  Bottom 0.254: J16.7 v34.29,15.24
JE_7
  Bottom 0.254: J9.40 33.02,24.13 33.02,11.43 J16.8
LCD_D0
  Top 0.254: J9.4 41.27,71.12 42.55,69.85 42.55,60.96 43.81,59.69 61.91,59.69 63.25,61.03 LCD1.7
LCD_D1
  Top 0.254: J9.5 30.48,69.85 40.01,69.85 41.27,68.58 41.27,59.69 42.55,58.42 64.45,58.42 65.79,59.76 LCD1.8
LCD_D2
  Top 0.254: J9.6 38.73,68.58 40.01,67.31 40.01,58.42 41.27,57.15 66.99,57.15 68.33,58.49 LCD1.9
LCD_D3
  Top 0.254: J9.7 30.48,67.31 37.47,67.31 38.73,66.04 38.73,57.15 40.01,55.88 69.53,55.88 70.87,57.22 LCD1.10
LCD_D4
  Top 0.254: J9.8 36.2,66.04 37.47,64.77 37.47,55.88 38.73,54.61 72.07,54.61 73.41,55.95 LCD1.11
LCD_D5
  Top 0.254: J9.9 30.48,64.77 34.92,64.77 36.2,63.5 36.2,54.61 37.47,53.34 74.61,53.34 75.95,54.68 LCD1.12
LCD_D6
  Top 0.254: J9.10 33.66,63.5 34.92,62.23 34.92,53.34 36.2,52.07 77.15,52.07 78.49,53.41 LCD1.13
LCD_D7
  Top 0.254: J9.13 30.48,59.69 32.38,59.69 33.66,58.42 33.66,52.07 34.92,50.8 79.69,50.8 81.03,52.14 LCD1.14
LCD_E
  Top 0.254: J9.3 30.48,72.39 42.55,72.39 43.81,71.12 43.81,62.23 45.09,60.96 59.37,60.96 60.71,62.3 LCD1.6
LCD_R/W
  Top 0.254: J9.2 43.81,73.66 45.09,72.39 45.09,63.5 46.35,62.23 56.83,62.23 58.17,63.57 LCD1.5
LCD_RS
  Top 0.254: J9.1 30.48,74.93 45.09,74.93 46.35,73.66 46.35,64.77 47.62,63.5 54.29,63.5 55.63,64.84 LCD1.4
N$1
  Top 0.254: U1.3 120.65,66.04 120.02,65.41 C6.2
N$2
  Top 0.254: C5.1 118.64,70.27 119.38,69.53 U1.2
N$3
  Top 0.254: U1.1 117.26,67.47 C6.1
N$4
  Top 0.254: C7.1 121.92,65.62 U1.4
N$5
  Top 0.254: U1.5 123.19,65.62 C7.2
N$6
  Top 0.254: C8.1 125.09,65.41 124.46,66.04 U1.6
N$7
  Top 0.254: R3.1 61.58,81.55 S1.2 61.95,81.04 64.14,78.85 65.42,78.85 67.53,80.96 71.12,80.96 J4.8 74.3,84.14 89.53,84.14 J5.8
  Bottom 0.254: U102.6 72.07,73.66 71.12,74.61 71.12,80.96 J4.8
N$8  (via drill 0.35)
  Top 0.254: LED3.A 130.66,81.69 R6.1 v130.81,82.87
  Bottom 0.254: v130.81,82.87 130.81,76.86 Q103.3
N$9  (via drill 0.35)
  Top 0.254: U1.14 120.65,82.23 v120.02,82.87
  Bottom 0.254: v120.02,82.87 119.78,83.1 J6.2
N$10  (via drill 0.35)
  Top 0.254: U1.13 121.92,82.23 v122.56,82.87
  Bottom 0.254: v122.56,82.87 J6.3
N$11  (via drill 0.35)
  Top 0.254: LED5.A 94.13,78.37 R9.1 v96.52,79.69
  Bottom 0.254: v96.52,79.69 96.52,73.06 Q101.3
N$12  (via drill 0.35)
  Top 0.254: LED2.A 126.22,81.69 R5.1 v126.36,82.87
  Bottom 0.254: v126.36,82.87 126.36,76.86 Q104.3
N$13  (via drill 0.35)
  Top 0.254: LED6.A 98.58,78.37 R10.1 v100.97,79.69
  Bottom 0.254: v100.97,79.69 100.97,73.06 Q100.3
N$14
  Top 0.254: R2.2 62.69,83.56 64.12,84.98 65.51,84.98 67.59,82.9 | S1.5 67.59,82.9 | J5.7 90.81,86.68 75.56,86.68 J4.7 70.1,85.41 67.59,82.9
  Bottom 0.254: U102.7 72.71,74.93 71.75,75.88 71.75,80.01 72.71,80.96 86.68,80.96 91.12,85.41 J5.7
N$15
  Top 0.254: S1.6 67.59,85.07 R4.1
N$16
  Bottom 0.254: U102.3 U102.2 79.69,74.93 79.06,75.56 79.06,76.83 79.69,77.47 87.63,77.47 88.27,76.83 R109.1 88.27,73.06 Q102.3
N$17
  Top 0.254: S1.3 61.95,85.07 R4.2
N$18
  Bottom 0.254: LCD1.2 50.55,76.13 R8.2
N$19
  Bottom 0.254: LCD1.16 88.38,65.67 R108.1
N$20
  Bottom 0.254: R107.1 U101.1
N$21
  Bottom 0.254: R106.1 U101.3
N$22
  Bottom 0.254: R105.1 U101.5
N$23
  Bottom 0.254: R104.1 U101.7
N$24
  Top 0.254: U2.13 42.83,23.84 41.91,24.77 U3.10
N$25
  Top 0.254: R14.1 LED10.A
N$26
  Top 0.254: R13.1 LED9.A
N$27
  Top 0.254: R12.1 LED8.A
N$28
  Top 0.254: R11.1 LED7.A
N$29
  Top 0.254: U2.10 44.77,23.25 44.77,23.81 45.72,24.77 U3.13
N$31
  Top 0.254: U2.11 44.13,24.45 44.45,24.77 U3.12
N$32  (via drill 0.35)
  Top 0.254: C2.1 C1.1 | v151.45,92.08 v151.46,92.09 CN1.VBUS 151.46,93.41 152.16,92.71 153.35,92.71 154.94,91.12 154.94,85.09 153.99,84.14 152.08,84.14 150.71,82.77 C1.1 | J7.1 141.6,79.38 140.65,80.33 140.65,82.23 141.6,83.19 146.26,83.19 C1.1
  Bottom 0.254: U103.20 148.88,89.51 v151.45,92.08
N$33
  Bottom 0.254: R103.1 U100.1
N$34
  Top 0.254: R1.1 LED1.A
N$35  (via drill 0.35)
  Top 0.254: LED1.C 153.45,89.95 153.03,89.53 153.01,89.56 v150.81,89.56
  Bottom 0.254: U103.23 150.84,88.63 | 150.84,88.63 | 150.84,88.63 150.84,89.53 v150.81,89.56
N$36
  Top 0.254: R7.1 LED4.A
N$39
  Bottom 0.254: R102.1 U100.3
N$40
  Bottom 0.254: R101.1 U100.5
N$41
  Bottom 0.254: R100.1 U100.7
N$42
  Top 0.254: R18.1 LED14.A
N$43
  Top 0.254: R17.1 LED13.A
N$44
  Top 0.254: R16.1 LED12.A
N$45
  Top 0.254: R15.1 LED11.A
N$46  (via drill 0.35)
  Top 0.254: LED4.C 153.45,88.48 153.03,88.9 v150.18,88.9
  Bottom 0.254: U103.22 150.18,85.58 v150.18,88.9
N$47  (via drill 0.35)
  Top 0.254: v150.5,92.08 150.66,92.24 CN1.D-
  Bottom 0.254: U103.16 146.28,87.86 v150.5,92.08
N$48  (via drill 0.35)
  Top 0.254: CN1.D+ 149.86,92.37 v149.55,92.06
  Bottom 0.254: v149.55,92.06 145.63,88.15 U103.15
N$49  (via drill 0.35)
  Top 0.254: v148.23,88.88 147.96,88.61 147.96,85.41 147,84.45 J7.3
  Bottom 0.254: U103.17 146.94,87.58 v148.23,88.88
N$50  (via drill 0.35)
  Top 0.254: v151.45,82.55 152.82,82.55 C3.1
  Bottom 0.254: J7.2 144.46,79.69 151.45,79.69 | U103.4 152.13,79 151.45,79.69 | 151.45,79.69 v151.45,82.55
N$94
  Top 0.254: U2.12 43.48,24.46 43.18,24.77 U3.11
N$97  (via drill 0.35)
  Top 0.508: R19.2 142.88,16.25 140.07,19.05 v138.75,19.05
  Bottom 1.016: S3.3 140.61,17.18 v138.75,19.05 135.25,19.05 132.08,22.23 132.08,24.77 133.22,25.91 U$1.IN+
N$98
  Top 0.508: LED15.A R19.1
N$100
  Bottom 1.016: 139.14,13.7 J29.PWR | S3.2 138.11,14.72 139.14,13.7 | X2.1 135.6,10.16 139.14,13.7
N$101  (via drill 0.35)
  Top 0.508: LED15.C 145,22 146.05,20.95 v146.05,8.97
  Bottom 1.016: U$1.IN- 154.05,25.91 155.19,24.76 J29.GNDBREAK 152.19,7.7 J29.GND 149.22,8.97 v146.05,8.97 140.82,8.97 X2.2
N$112  (via drill 0.35)
  Top 0.254: v48.26,27.94 U3.15
  Bottom 0.254: v48.26,27.94 48.26,20.95 50.16,19.05 J17.2
OPTO_0
  Bottom 0.254: U101.15 100.65,24.77 102.55,22.86 RN101.1 101.6,21.91 100.65,20.95 100.65,19.28 102.55,17.37 J18.1 102.55,13.65 99.69,10.79 J24.1
OPTO_1
  Bottom 0.254: U101.13 103.19,23.5 103.82,22.86 RN101.2 103.82,21.59 103.19,20.95 101.92,20.95 101.28,20.32 101.28,19.68 101.92,19.05 104.46,19.05 105.09,18.41 J18.2 105.09,14.29 100.17,9.37 J24.2
OPTO_2
  Bottom 0.254: U101.11 105.73,23.5 105.09,22.86 RN101.3 105.09,21.59 105.73,20.95 107,20.95 107.63,20.32 J18.3 107.63,13.17 J25.1
OPTO_3
  Bottom 0.254: U101.9 108.27,24.77 106.36,22.86 RN101.4 109.22,21.91 110.17,20.95 J18.4 110.17,7.01 J25.2
OPTO_4
  Bottom 0.254: U100.15 114.62,24.77 116.52,22.86 RN100.1 113.67,21.91 112.71,20.95 J18.5 112.71,11.89 J26.1
OPTO_5
  Bottom 0.254: U100.13 117.16,23.5 117.79,22.86 RN100.2 117.79,21.59 117.16,20.95 115.89,20.95 115.25,20.32 J18.6 115.25,13.02 117.32,10.95 J26.2
OPTO_6
  Bottom 0.254: U100.11 119.7,23.5 119.06,22.86 RN100.3 119.06,21.59 119.7,20.95 120.97,20.95 121.6,20.32 121.6,19.68 120.97,19.05 118.43,19.05 117.79,18.41 J18.7 117.79,13.02 120.03,10.79 J27.1
OPTO_7
  Bottom 0.254: U100.9 122.24,24.77 120.33,22.86 RN100.4 121.28,21.91 122.24,20.95 122.24,18.82 120.33,16.92 J18.8 120.33,15.56 125.89,10 J27.2
OUT_0  (via drill 0.35)
  Top 0.254: R11.2 98.11,30.75 v98.11,36.2
  Bottom 0.254: R107.2 98.48,35.83 v98.11,36.2 67.31,36.2 61.59,30.48 J9.36
OUT_1  (via drill 0.35)
  Top 0.254: v100.65,36.2 100.65,30.75 R12.2
  Bottom 0.254: R106.2 101.02,35.83 v100.65,36.2 99.38,37.47 66.67,37.47 60.96,31.75 30.48,31.75 J9.35
OUT_2  (via drill 0.35)
  Top 0.254: R13.2 103.19,30.75 v103.19,36.2
  Bottom 0.254: R105.2 103.56,35.83 v103.19,36.2 100.65,38.73 66.04,38.73 60.33,33.02 J9.34
OUT_3  (via drill 0.35)
  Top 0.254: v105.73,36.2 105.73,30.75 R14.2
  Bottom 0.254: R104.2 106.1,35.83 v105.73,36.2 101.92,40.01 65.41,40.01 59.69,34.29 30.48,34.29 J9.33
OUT_4  (via drill 0.35)
  Top 0.254: v114.62,36.2 114.62,28.2 R15.2
  Bottom 0.254: R103.2 114.25,35.83 v114.62,36.2 109.54,41.27 64.77,41.27 59.05,35.56 J9.32
OUT_5  (via drill 0.35)
  Top 0.254: R16.2 117.16,28.2 v117.16,36.2
  Bottom 0.254: R102.2 116.79,35.83 v117.16,36.2 110.81,42.55 64.14,42.55 58.42,36.83 30.48,36.83 J9.31
OUT_6  (via drill 0.35)
  Top 0.254: v119.7,36.2 119.7,28.2 R17.2
  Bottom 0.254: R101.2 119.33,35.83 v119.7,36.2 112.08,43.81 63.5,43.81 57.78,38.1 34.29,38.1 J9.28
OUT_7  (via drill 0.35)
  Top 0.254: R18.2 122.87,28.84 v122.87,36.2
  Bottom 0.254: R100.2 122.5,35.83 v122.87,36.2 113.98,45.09 62.87,45.09 57.15,39.37 35.56,39.37 33.02,41.91 30.48,41.91 J9.27
PLANE_BOTTOM
  pour Bottom: 155.02,0 5,0 arc-90 0,5 0,97.87 arc-90 5,102.87 102.23,102.87 arc-90 104.78,100.33 104.78,98.42 arc90 107.31,95.89 137.79,95.89 arc90 140.34,98.42 140.34,100.33 arc-90 142.88,102.87 155.02,102.87 arc-90 160.02,97.87 160.02,5 arc-90
PLANE_TOP
  pour Top: 104.78,98.42 104.78,100.33 arc90 102.23,102.87 5,102.87 arc90 0,97.87 0,5 arc90 5,0 155.02,0 arc90 160.02,5 160.02,97.87 arc90 155.02,102.87 142.88,102.87 arc90 140.34,100.33 140.34,98.42 arc-90 137.79,95.89 107.31,95.89 arc-90
SW_0
  Bottom 0.254: J9.14 62.87,58.42 64.14,57.15 S100.1 64.14,50.16 62.23,48.26 RN102.8
SW_1
  Bottom 0.254: J9.15 30.48,57.15 32.38,57.15 33.02,57.78 60.33,57.78 61.59,56.52 S100.2 61.59,49.53 60.96,48.9 RN102.7
SW_2
  Bottom 0.254: J9.16 33.02,55.88 34.29,57.15 57.78,57.15 59.05,55.88 S100.3 59.05,49.53 59.69,48.9 RN102.6
SW_3
  Bottom 0.254: J9.17 30.48,54.61 33.66,54.61 35.56,56.52 55.24,56.52 56.52,55.24 S100.4 56.52,50.16 58.42,48.26 RN102.5
SW_4
  Bottom 0.254: J9.18 34.29,53.34 36.83,55.88 52.7,55.88 53.98,54.61 S100.5 53.98,50.16 52.07,48.26 RN103.8
SW_5
  Bottom 0.254: J9.19 30.48,52.07 34.92,52.07 38.1,55.24 50.16,55.24 51.44,53.98 S100.6 51.44,49.53 50.8,48.9 RN103.7
SW_6
  Bottom 0.254: J9.20 35.56,50.8 39.37,54.61 47.62,54.61 48.9,53.34 S100.7 48.9,49.53 49.53,48.9 RN103.6
SW_7
  Bottom 0.254: J9.21 30.48,49.53 36.2,49.53 40.64,53.98 45.09,53.98 46.35,52.7 S100.8 46.35,50.16 48.26,48.26 RN103.5
VCC
  Top 0.254: J16.12 29.21,7.62 | 29.21,7.62 6.35,7.62 | 6.35,7.62 J15.12 | 41.91,95.89 J2.12 | 41.91,95.89 19.05,95.89 | 19.05,95.89 J1.12 | 41.91,95.89 63.5,95.89 64.77,94.61 J3.12 | 6.35,7.62 3.81,7.62 2.54,8.89 2.54,94.61 3.81,95.89 19.05,95.89 | 29.21,7.62 31.11,5.71 44.77,5.71 46.04,6.99 J19.2
  Bottom 0.254: J1.12 J1.11 | J2.12 J2.11 | J3.12 J3.11 | J15.11 J15.12 | J16.11 J16.12
VCCA
  Top 0.508: U$1.OUT+ 134.87,37.08 128.91,31.11 128.91,5.71 127,3.81 72.11,3.81 J21.2
  Bottom 0.254: U100.10 120.97,27.3 118.43,27.3 | 118.43,27.3 U100.12 | 118.43,27.3 115.89,27.3 | 115.89,27.3 113.35,27.3 | 113.35,27.3 107,27.3 | 107,27.3 104.46,27.3 | 104.46,27.3 101.92,27.3 | 101.92,27.3 U101.14 | 104.46,27.3 U101.12 | 107,27.3 U101.10 | 113.35,27.3 U100.16 | 115.89,27.3 U100.14 | U101.16 99.38,26.67 100.01,27.3 101.92,27.3
  Bottom 0.508: U$1.OUT+ 134.87,37.08 125.09,27.3 120.97,27.3 | J20.2 61.76,7.29 | 61.76,7.29 J20.1 | J21.2 70.33,7.29 J21.1 65.26,10.79 61.76,7.29

## Text on the board
tPlace: OFF END Resistor ON | MAX232 FTDI
bPlace: FPGA - Expanssion Development Board | REV: B | Design: L.E. Fdez
tNames: TX / / / RX | 2 4 6 8 GND VCC / 1 3 5 7 GND VCC | 10 14 16 18 GND VCC / 9 13 15 17 GND VCC | 20 22 24 26 / 19 21 23 25 | RS232 PORT | RS485 PORT | TX RX | TX RX | Pmod Header Breakout / / / Peripheral Header | Analog Voltage Supply | VCC GND 35 33 31 27 / VCC GND 36 34 32 28 | VCC GND 40 39 38 37 / VCC GND SCK MISO MOSI CS
bNames: Device Address (0-255) / Default 0 | ADC 6 ADC 4 ADC 2 ADC 0 | ADC 7 ADC 5 ADC 3 ADC 1 | GND VCC | OUT 6 OUT 4 OUT 2 OUT 0 | OUT 7 OUT 5 OUT 3 OUT 1 | GND VCC